# Altium schematic sheet POWER.SchDoc
size A3; SheetNumber: 5; SheetTotal: 5
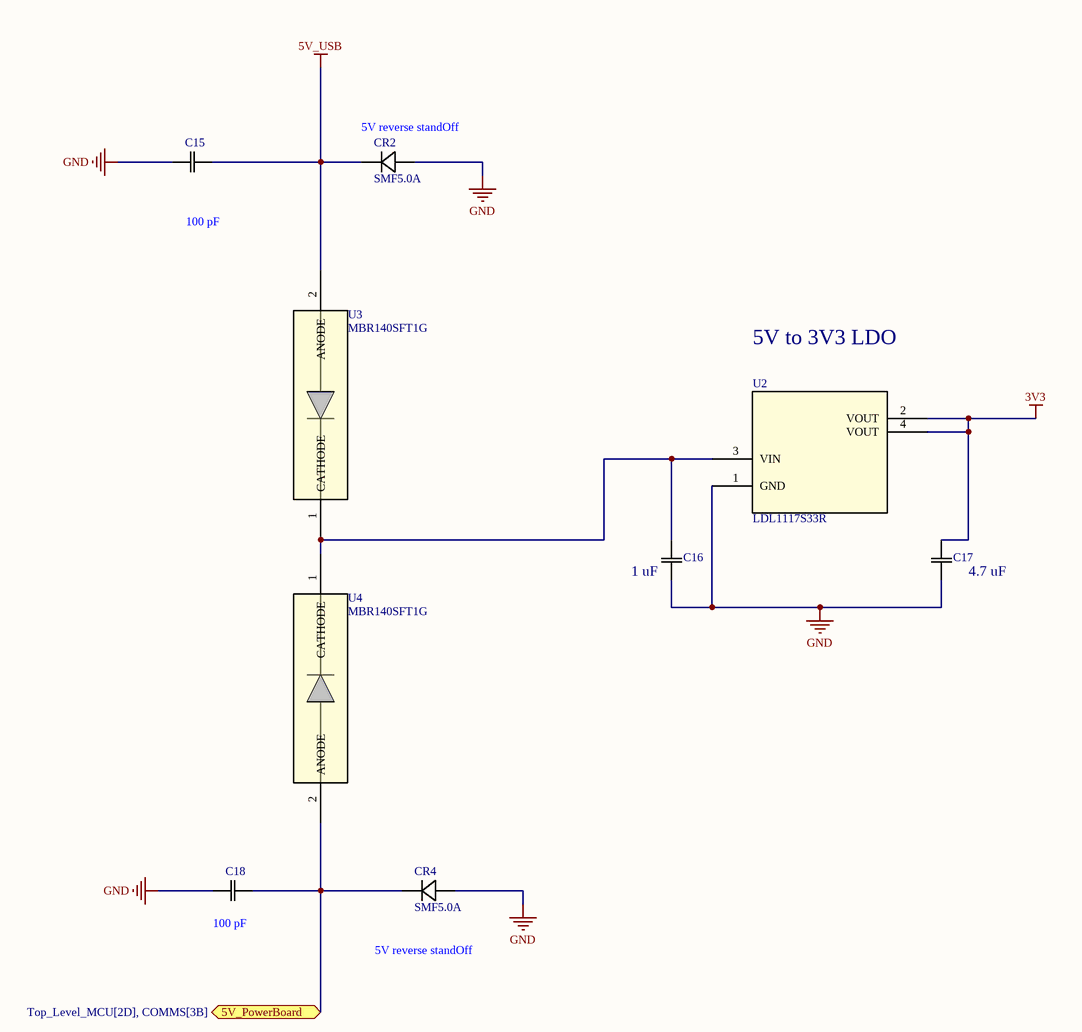
[diagram p0: POWER.SchDoc]

## Parts
C15  CC0805KRX7R7BB104  [CC0805N_YAG]  (value not drawn)
C16  CC0805KRX7R7BB104  [CC0805N_YAG]  (value not drawn)
C17  CC0805KRX7R7BB104  [CC0805N_YAG]  (value not drawn)
C18  CC0805KRX7R7BB104  [CC0805N_YAG]  (value not drawn)
CR2  SMF5.0A  [SMFSeries_LTF]
CR4  SMF5.0A  [SMFSeries_LTF]
U2  LDL1117S33R  [SOT223_STM]
U3  MBR140SFT1G  [SOD_40SFT1G_ONS]
U4  MBR140SFT1G  [SOD_40SFT1G_ONS]

## Ports
5V_PowerBoard (bidir, see Top_Level_MCU[2D], COMMS[3B])

## Nets
3V3: C17.2 U2.2(VOUT) U2.4(VOUT)
5V_USB: C15.2 CR2.1 U3.2(ANODE)
GND: C15.1 C16.1 C17.1 C18.1 CR2.2 CR4.2 U2.1(GND)
5V_PowerBoard: C18.2 CR4.1 U4.2(ANODE) ; port 5V_PowerBoard
NetC16_2: C16.2 U2.3(VIN) U3.1(CATHODE) U4.1(CATHODE)

## Notes on the sheet
- (near CR2) 5V reverse standOff
- (near C15) 100 pF
- 5V to 3V3 LDO
- (near C16) 1 uF
- (near C17) 4.7 uF
- (near C18) 100 pF
- (near CR4) 5V reverse standOff

## Library data of the parts
C15-C18 = CC0805KRX7R7BB104: Description; Manufacturer_Name: Yageo; Copyright: Copyright (C) 2025 Ultra Librarian. All rights reserved.; Manufacturer_Part_Number: CC0805KRX7R7BB104
CR2 CR4 = SMF5.0A: Description; Manufacturer_Name: Littelfuse Inc; Copyright: Copyright (C) 2025 Ultra Librarian. All rights reserved.; Manufacturer_Part_Number: SMF5.0A
U2 = LDL1117S33R: 1.2 A High PSRR low dropout linear voltage regulator; Manufacturer_Name: STMicroelectronics; Copyright: Copyright (C) 2025 Ultra Librarian. All rights reserved.; Manufacturer_Part_Number: LDL1117S33R; RefDes: RefDes; Type: Type
U3 U4 = MBR140SFT1G: Description; Manufacturer_Name: onsemi; Copyright: Copyright (C) 2026 Ultra Librarian. All rights reserved.; Manufacturer_Part_Number: MBR140SFT1G; RefDes: RefDes; Type: Type